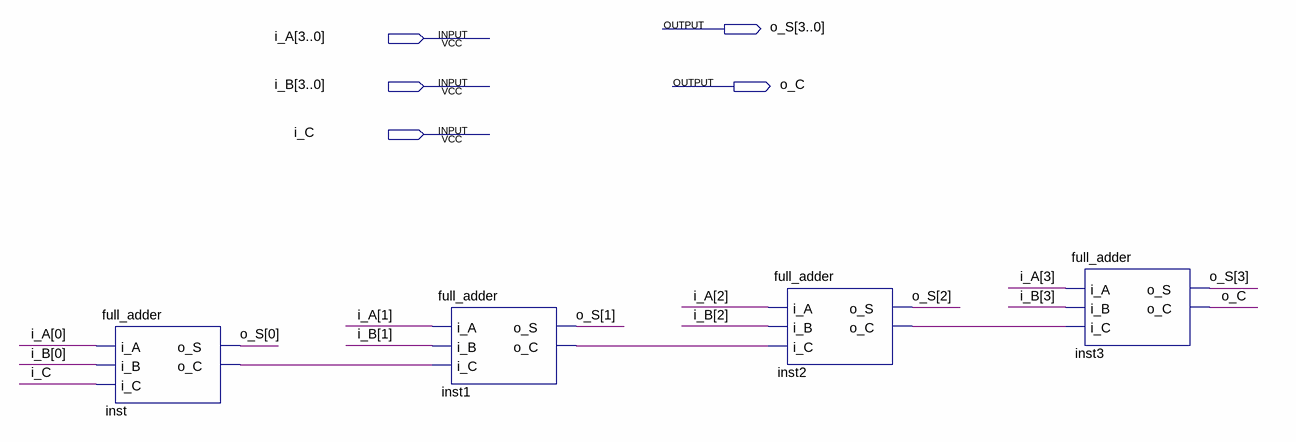
[diagram p0: schematic sheet]
// Quartus schematic rca_4bit.bdf as structural Verilog: 4 symbols, 5 pins
module rca_4bit (
  input  [3:0] i_A,
  input  [3:0] i_B,
  input  i_C,
  output [3:0] o_S,
  output o_C
);

  wire inst1_o_c, inst2_o_c, inst_o_c;

  full_adder inst (.i_A(i_A[0]), .i_B(i_B[0]), .i_C(i_C), .o_S(o_S[0]), .o_C(inst_o_c));
  full_adder inst1 (.i_A(i_A[1]), .i_B(i_B[1]), .i_C(inst_o_c), .o_S(o_S[1]), .o_C(inst1_o_c));
  full_adder inst2 (.i_A(i_A[2]), .i_B(i_B[2]), .i_C(inst1_o_c), .o_S(o_S[2]), .o_C(inst2_o_c));
  full_adder inst3 (.i_A(i_A[3]), .i_B(i_B[3]), .i_C(inst2_o_c), .o_S(o_S[3]), .o_C(o_C));
endmodule
